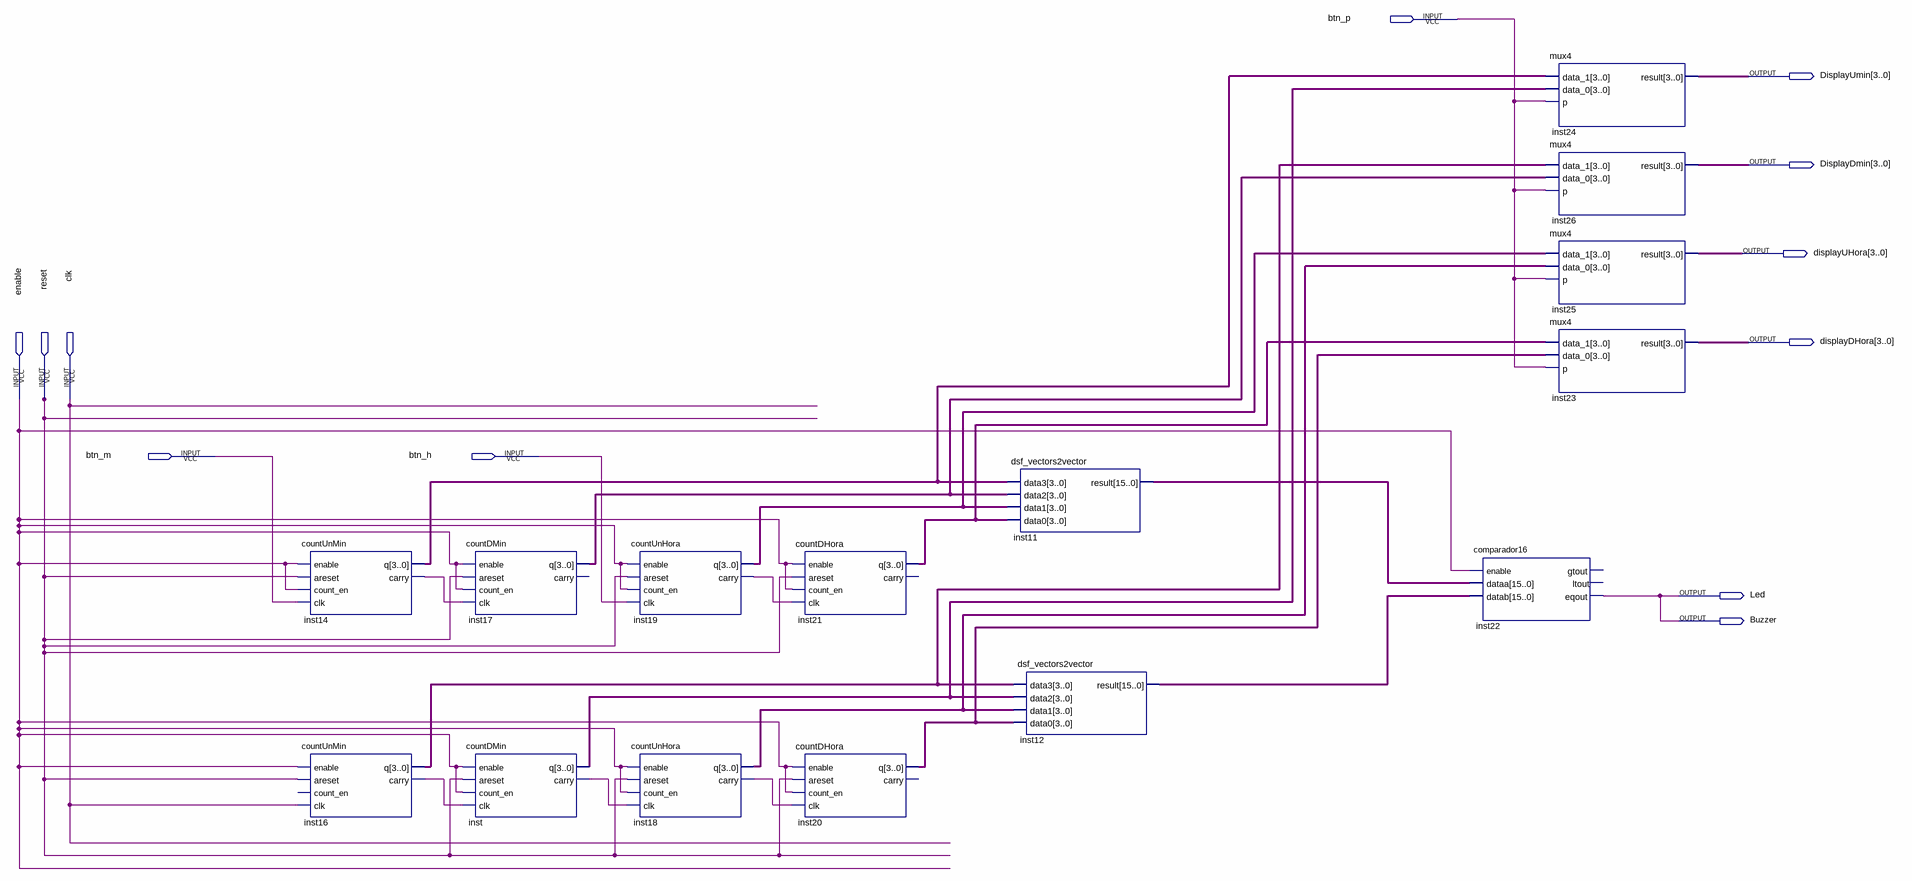
[diagram p0: schematic sheet]
// Quartus schematic Despertador.bdf as structural Verilog: 15 symbols, 12 pins
module Despertador (
  input  btn_p,
  input  enable,
  input  reset,
  input  clk,
  input  btn_m,
  input  btn_h,
  output [3:0] DisplayUmin,
  output [3:0] DisplayDmin,
  output [3:0] displayUHora,
  output [3:0] displayDHora,
  output Led,
  output Buzzer
);

  wire inst14_carry, inst16_carry, inst18_carry, inst19_carry, inst_carry;
  wire [3:0] inst14_q, inst16_q, inst17_q, inst18_q, inst19_q, inst20_q, inst21_q, inst_q;
  wire [15:0] inst11_result, inst12_result;

  countUnMin inst14 (
    .enable(enable), .areset(reset), .count_en(enable), .clk(btn_m), .q(inst14_q), .carry(inst14_carry));
  countUnMin inst16 (.enable(enable), .areset(reset), .clk(clk), .q(inst16_q), .carry(inst16_carry));  // open: count_en
  countDMin inst17 (
    .enable(enable), .areset(reset), .count_en(enable), .clk(inst14_carry), .q(inst17_q));  // open: carry
  countDMin inst (
    .enable(enable), .areset(reset), .count_en(enable), .clk(inst16_carry), .q(inst_q), .carry(inst_carry));
  countUnHora inst19 (
    .enable(enable), .areset(reset), .count_en(enable), .clk(btn_h), .q(inst19_q), .carry(inst19_carry));
  countUnHora inst18 (
    .enable(enable), .areset(reset), .count_en(enable), .clk(inst_carry), .q(inst18_q), .carry(inst18_carry));
  countDHora inst21 (
    .enable(enable), .areset(reset), .count_en(enable), .clk(inst19_carry), .q(inst21_q));  // open: carry
  countDHora inst20 (
    .enable(enable), .areset(reset), .count_en(enable), .clk(inst18_carry), .q(inst20_q));  // open: carry
  dsf_vectors2vector inst11 (
    .data3(inst14_q), .data2(inst17_q), .data1(inst19_q), .data0(inst21_q), .result(inst11_result));
  dsf_vectors2vector inst12 (
    .data3(inst16_q), .data2(inst_q), .data1(inst18_q), .data0(inst20_q), .result(inst12_result));
  comparador16 inst22 (
    .enable(enable), .dataa(inst11_result), .datab(inst12_result), .eqout(Buzzer));  // open: gtout, ltout
  mux4 inst24 (.data_1(inst14_q), .data_0(inst_q), .p(btn_p), .result(DisplayUmin));
  mux4 inst26 (.data_1(inst16_q), .data_0(inst17_q), .p(btn_p), .result(DisplayDmin));
  mux4 inst25 (.data_1(inst19_q), .data_0(inst18_q), .p(btn_p), .result(displayUHora));
  mux4 inst23 (.data_1(inst21_q), .data_0(inst20_q), .p(btn_p), .result(displayDHora));

  assign Led = Buzzer;
endmodule
